# EAGLE design hh (EAGLE 8.7.1)
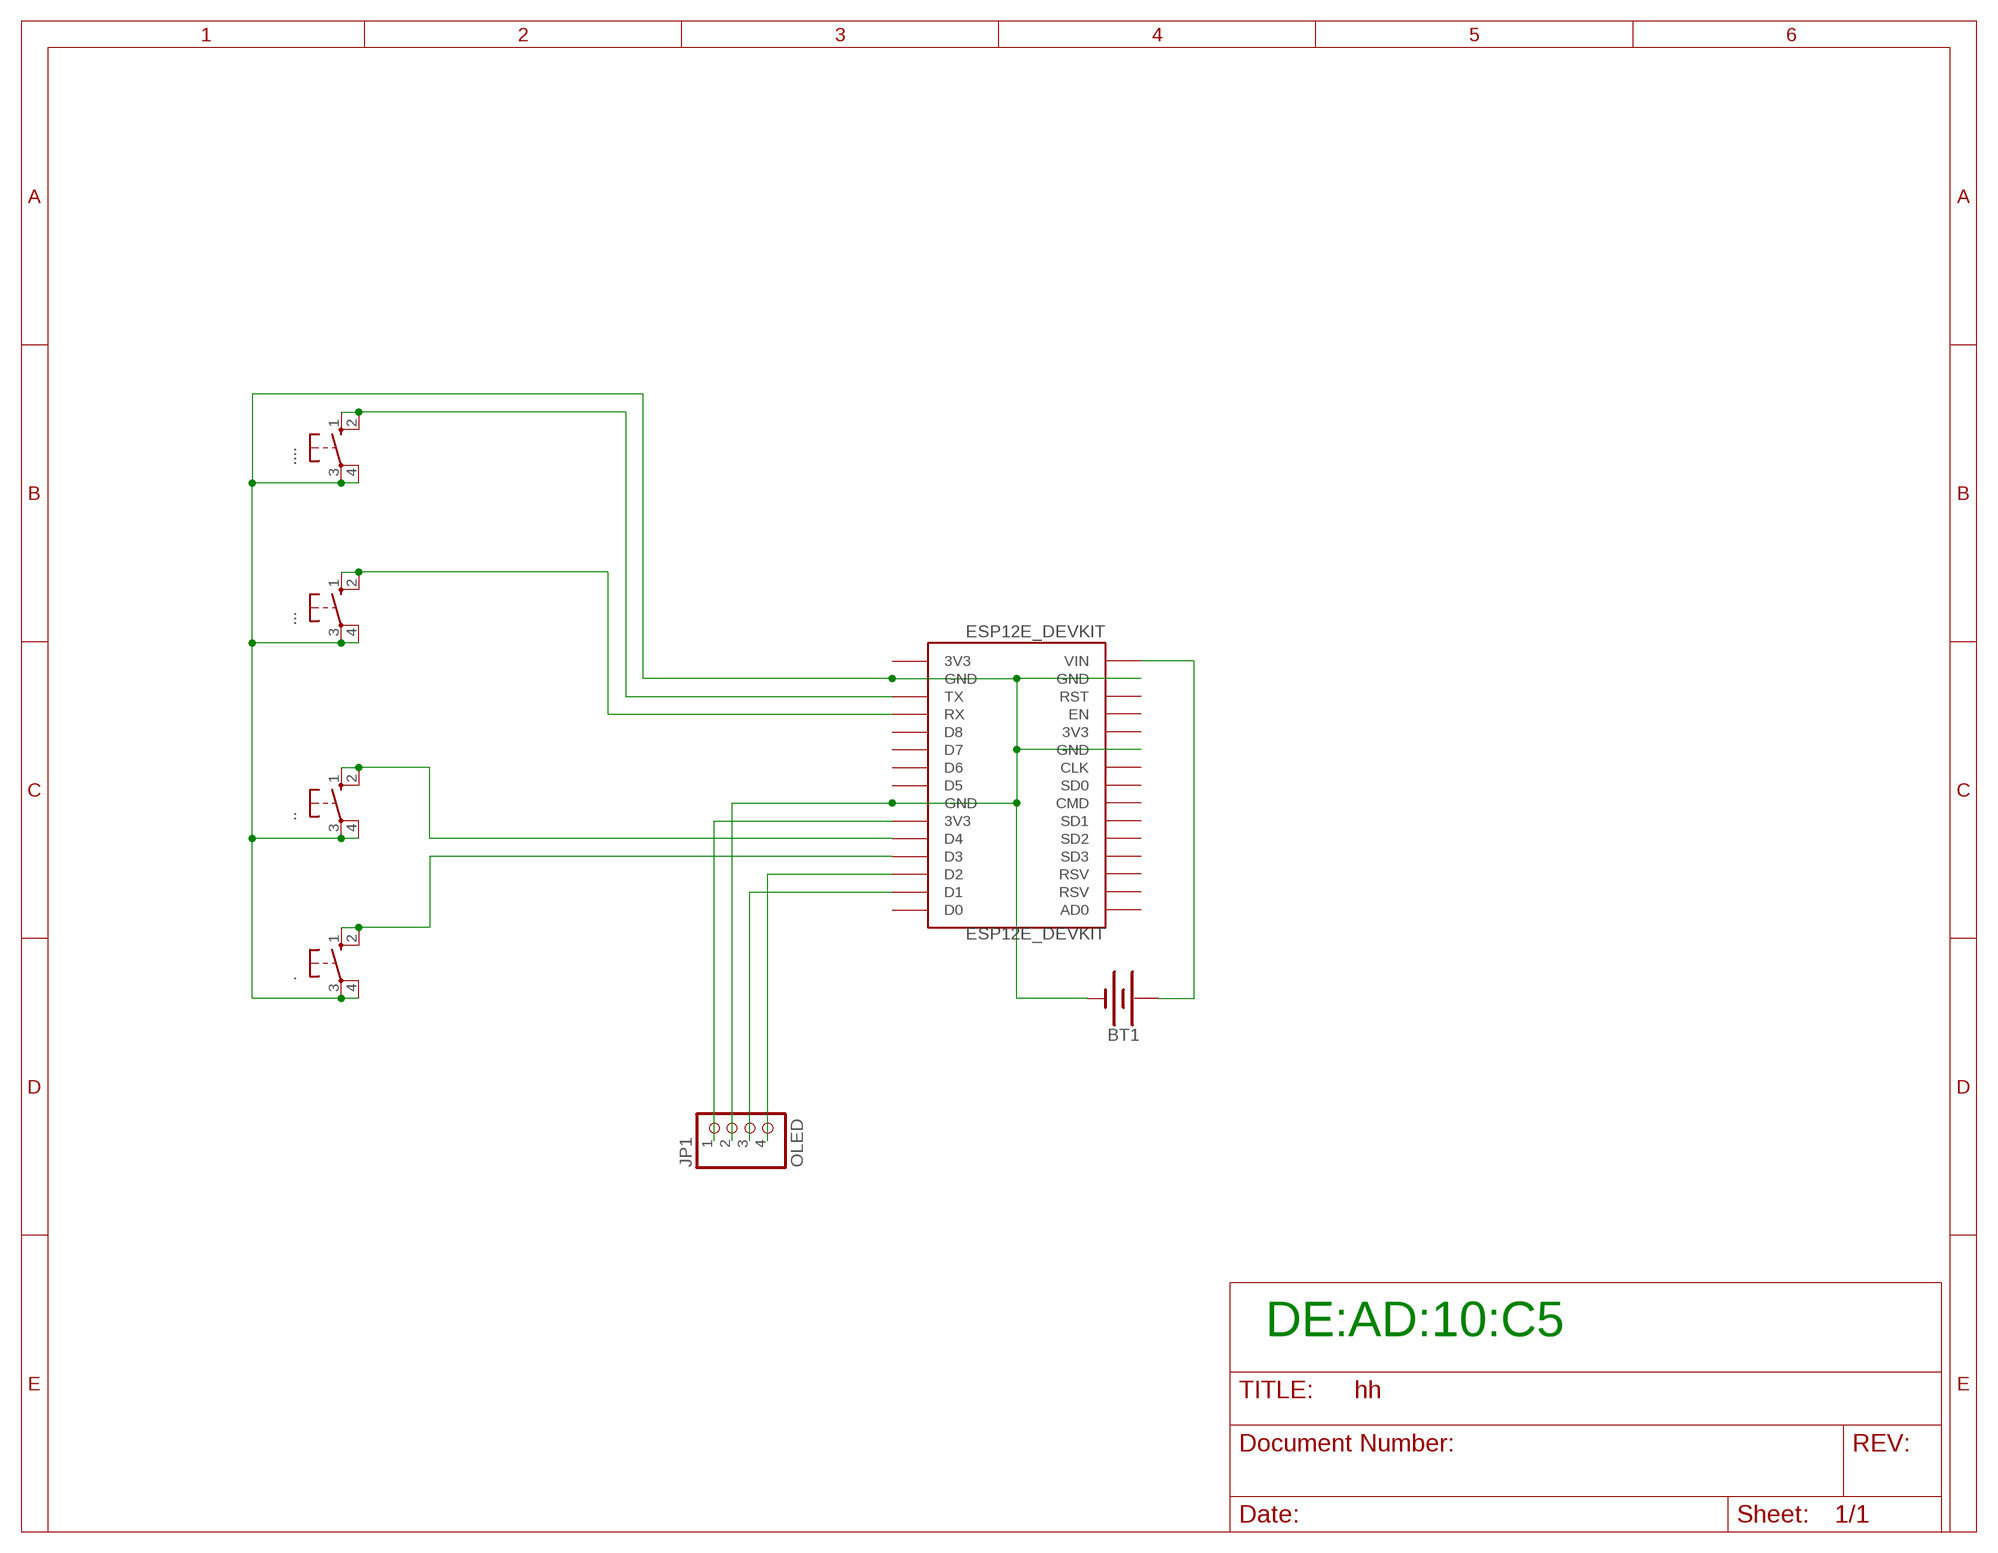
[diagram p0: schematic, sheet 1]

## Parts
.  10-XX  [B3F-10XX]
..  10-XX  [B3F-10XX]
...  10-XX  [B3F-10XX]
....  10-XX  [B3F-10XX]
BT1  BATTERY-18650  [BATTERY_18650-HOLDER]
ESP12E_DEVKIT  ESP12E_DEVKIT  [ESP12E_DEVKIT]
JP1  OLED  PINHD-1X4  [1X04]

## Nets
N$1: ..3(P) ..4(P1) ...3(P) ...4(P1) ....3(P) ....4(P1) .....3(P) .....4(P1) BT1.GND@1(-) ESP12E_DEVKIT.GND@0(GND) ESP12E_DEVKIT.GND@1(GND) ESP12E_DEVKIT.GND@2(GND) ESP12E_DEVKIT.GND@3(GND) JP1.2
N$2: ..1(S) ..2(S1) ESP12E_DEVKIT.D3
N$3: ESP12E_DEVKIT.3V3@1(3V3) JP1.1
N$4: BT1.PWR@1(+) ESP12E_DEVKIT.VIN
N$5: ESP12E_DEVKIT.D1 JP1.3
N$6: ESP12E_DEVKIT.D2 JP1.4
N$7: ...1(S) ...2(S1) ESP12E_DEVKIT.D4
N$8: ....1(S) ....2(S1) ESP12E_DEVKIT.RX
N$9: .....1(S) .....2(S1) ESP12E_DEVKIT.TX
Unconnected: ESP12E_DEVKIT.3V3@0(3V3) ESP12E_DEVKIT.3V3@2(3V3) ESP12E_DEVKIT.AD0 ESP12E_DEVKIT.CLK ESP12E_DEVKIT.CMD ESP12E_DEVKIT.D0 ESP12E_DEVKIT.D5 ESP12E_DEVKIT.D6 ESP12E_DEVKIT.D7 ESP12E_DEVKIT.D8 ESP12E_DEVKIT.EN ESP12E_DEVKIT.RST ESP12E_DEVKIT.RSV@0(RSV) ESP12E_DEVKIT.RSV@1(RSV) ESP12E_DEVKIT.SD0 ESP12E_DEVKIT.SD1 ESP12E_DEVKIT.SD2 ESP12E_DEVKIT.SD3

## Notes on the sheet
- DE:AD:10:C5

## Library data of the parts
. .. ... .... = switch-omron:10-XX: OMRON SWITCH; MPN: B3F-1000; OC_FARNELL: 176432; OC_NEWARK: 36M3542
BT1 = SF_Batteries:BATTERY: Battery - Single Cell A variety of battery chemistries, sizes, and footprints. Device List: 20MM_PTH - Coin Cell Battery Holder - 20mm (PTH) <https://www.sparkfun.com/products/783> 12MM_SMD - Coin Cell Battery Holder - 12mm (SMD) <https://www.sparkfun.com/products/10592> 12MM_PTH - Coin Cell Battery Holder - 12mm (PTH) <https://www.sparkfun.com/products/7948> 20MM_SMD - 20mm Coin Cell Battery Holder (SMD) (2 legs) Used on the Big Time Watch Kit <https://www.sparkfun.com/products/11734> 20MM_SMD_4LEGS - Coin Cell Battery Holder - 20mm (SMD) <https://www.sparkfun.com/products/11892> 20MM_SMD_4LEGS_OVERPASTE - Coin Cell Battery Holder - 20mm (SMD) <https://www.sparkfun.com/products/11892> (Over-paste on the legs) 24.5MM_PTH - Coin Cell Battery Holder - 24.5mm (PTH) <https://www.sparkfun.com/products/8863> 9V - 9V Battery Holder - PC Mount Used on the SparkFun SparkPunk Sound Kit <https://www.sparkfun.com/products/11177> and SparkFun SparkPunk Sequencer Kit <https://www.sparkfun.com/products/12707> 18650 - Battery Holder - 18650 (PTH) <https://www.sparkfun.com/products/13113> AA - Battery Holder - 1xAA (PTH) <https://www.sparkfun.com/products/7949> AAA - Battery Holder - 1xAAA (PTH) <https://www.sparkfun.com/products/12718> AA_KIT - Battery Holder - 1xAA (PTH) <https://www.sparkfun.com/products/7949> Special kit package - pads only have exposed copper on one side of the board. AAA_KIT - Battery Holder - 1xAAA (PTH) <https://www.sparkfun.com/products/12718> Special kit package - pads only have exposed copper on one side of the board.; PROD_ID: BATT-12327; SF_SKU: PRT-13113
ESP12E_DEVKIT = ESP12E_DEVKIT:ESP12E_DEVKIT: ESP12E DEVKIT BOARD
JP1 = pinhead:PINHD-1X4: PIN HEADER

## Board
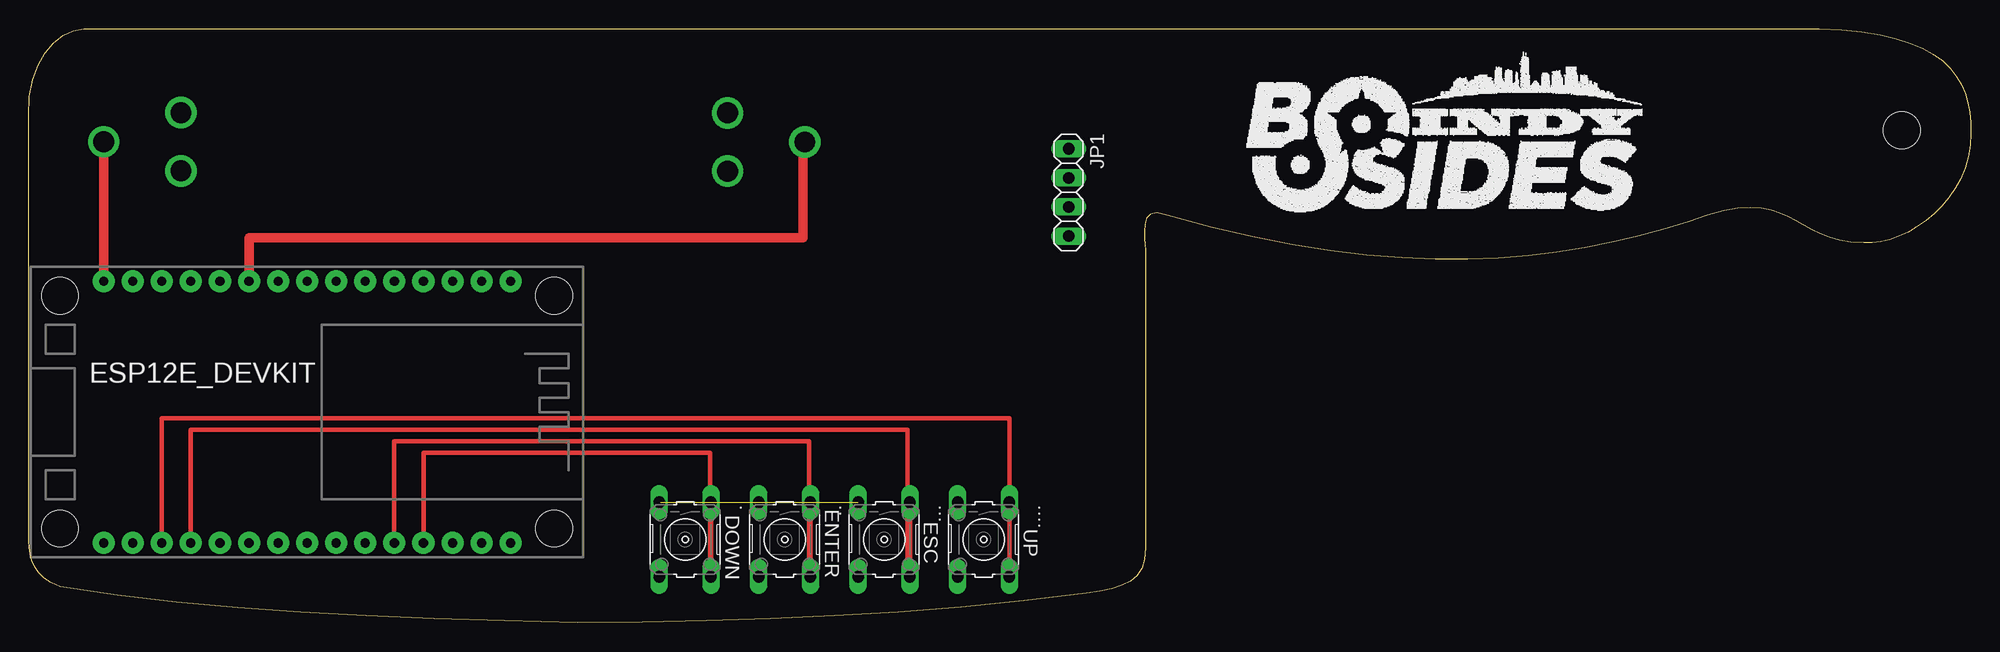
[diagram p1: board, top side]
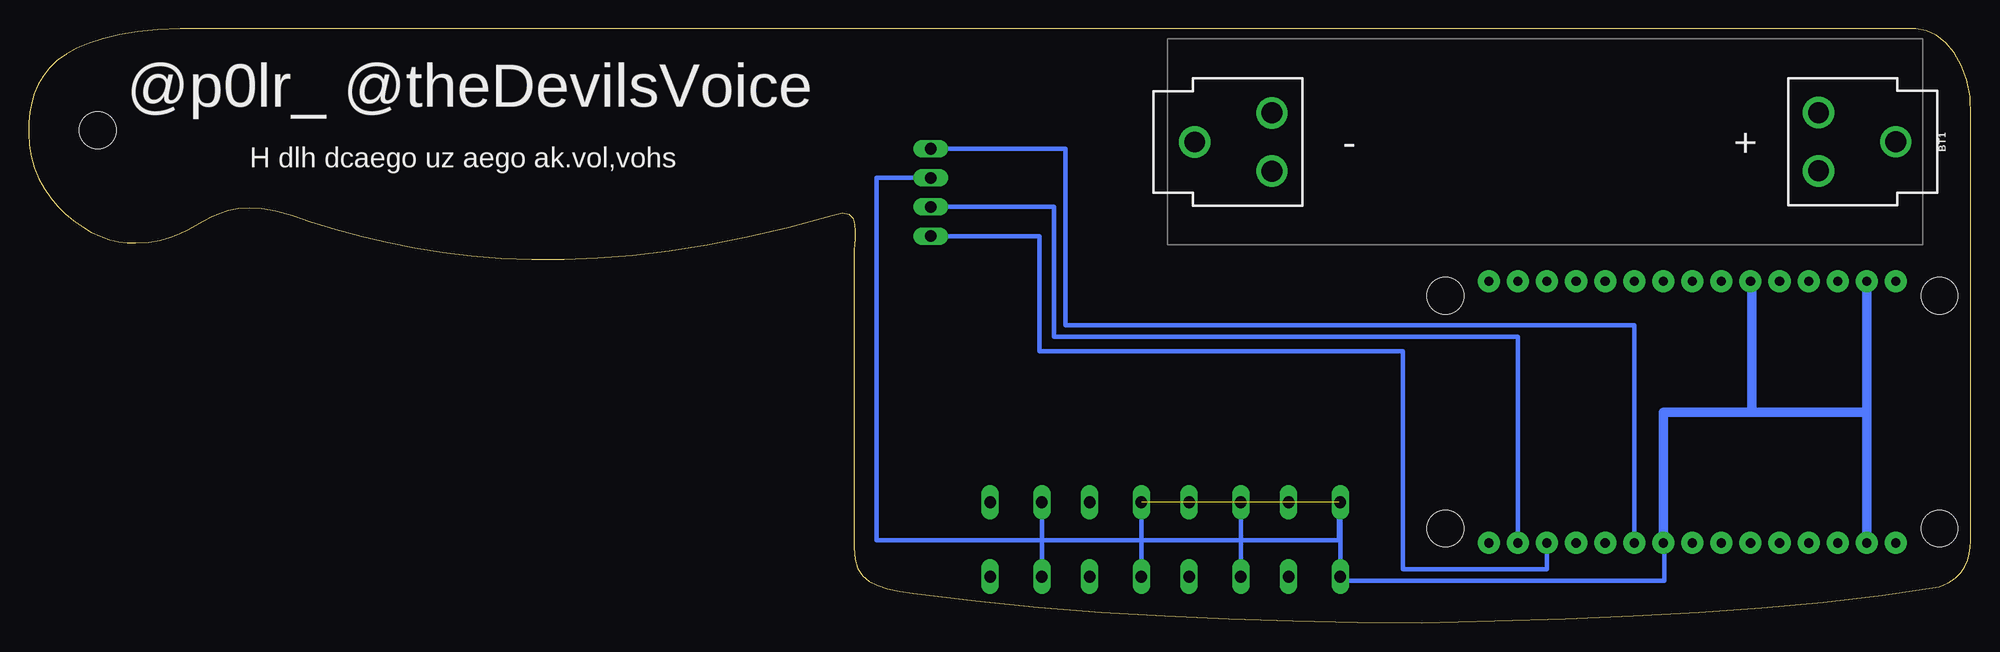
[diagram p2: board, bottom side, seen from below]

Size 169.71 x 51.92 mm. Coordinates in mm from the lower left corner, seen from the top.
Outline: 47.97,0 41.57,0.18 35.41,0.39 29.48,0.63 23.77,0.93 18.25,1.32 12.92,1.8 7.76,2.41 2.75,3.17 1.97,3.49 1.35,3.9 0.87,4.39 0.53,4.92 0.29,5.48 0.14,6.05 0.05,6.6 0,7.12 0,44.3 0.08,45.96 0.37,47.44 0.84,48.73 1.47,49.82 2.21,50.69 3.04,51.33 3.92,51.75 4.82,51.92 156.45,51.92 158.42,51.81 160.19,51.63 161.78,51.37 163.19,51.04 164.43,50.64 165.51,50.19 166.44,49.67 167.24,49.09 167.9,48.46 168.44,47.77 168.87,47.04 169.2,46.27 169.44,45.46 169.6,44.6 169.69,43.71 169.71,42.8 169.67,41.73 169.5,40.71 169.22,39.74 168.83,38.82 168.35,37.95 167.8,37.15 167.17,36.4 166.49,35.73 165.77,35.12 165,34.59 164.22,34.14 163.43,33.77 162.64,33.49 161.85,33.3 161.1,33.2 160.37,33.2 159.23,33.26 158.23,33.42 157.34,33.67 156.54,33.99 155.8,34.35 155.11,34.73 154.44,35.11 153.75,35.47 153.03,35.79 152.26,36.05 151.41,36.22 150.45,36.28 149.35,36.21 148.11,36 146.68,35.62 145.06,35.04 142.87,34.39 140.63,33.8 138.34,33.26 135.98,32.79 133.55,32.4 131.04,32.09 128.44,31.88 125.74,31.77 122.93,31.76 120,31.88 116.95,32.13 113.76,32.52 110.43,33.05 106.94,33.73 103.3,34.58 99.48,35.6 98.62,35.81 98.04,35.71 97.69,35.35 97.52,34.83 97.48,34.22 97.51,33.59 97.56,33.02 97.58,32.58 97.58,6.58 97.51,5.57 97.27,4.76 96.86,4.13 96.28,3.64 95.54,3.28 94.64,3 93.6,2.79 92.41,2.6 86.97,1.92 81.48,1.37 75.96,0.94 70.4,0.61 64.82,0.36 59.22,0.19 53.6,0.08 47.97,0
Copper layers (1*16): Top 0.0356mm / dielectric 1.5011mm / Bottom 0.0356mm
Design rules "oshpark-2layer": minimum track width 6mil, minimum drill 13mil, track to track 6mil, track to pad 6mil, pad to pad 6mil, via to via 6mil, smd to smd 6mil, copper to edge 15mil, drill to drill 6mil, minimum pad ring 7mil, minimum via ring 7mil, stop-mask expansion 2.5mil, vias tented up to drill 0mil, thermal gap 10mil
Holes 3.2 mm at 163.69,43.04

### Footprints (pad centres in the part's own frame; a part is rotated, then mirrored left to right if it is on the bottom)
B3F-10XX = drill 1.016 long: 1 -3.251,2.261; 2 3.251,2.261; 3 -3.251,-2.261; 4 3.251,-2.261
BATTERY_18650-HOLDER = drill 1.829: GND@1 30.628,0.01; GND@2 23.88,2.55; GND@3 23.88,-2.53; PWR@1 -30.628,-0.01; PWR@2 -23.88,2.53; PWR@3 -23.88,-2.55
ESP12E_DEVKIT = drill 0.8 pad 1.93: 3V3@0 -11.43,-7.62; 3V3@1 11.43,5.08; 3V3@2 11.43,-17.78; AD0 -11.43,17.78; CLK -11.43,-2.54; CMD -11.43,2.54; D0 11.43,17.78; D1 11.43,15.24; D2 11.43,12.7; D3 11.43,10.16; D4 11.43,7.62; D5 11.43,0; D6 11.43,-2.54; D7 11.43,-5.08; D8 11.43,-7.62; EN -11.43,-10.16; GND@0 -11.43,-5.08; GND@1 -11.43,-15.24; GND@2 11.43,2.54; GND@3 11.43,-15.24; RST -11.43,-12.7; RSV@0 -11.43,15.24; RSV@1 -11.43,12.7; RX 11.43,-10.16; SD0 -11.43,0; SD1 -11.43,5.08; SD2 -11.43,7.62; SD3 -11.43,10.16; TX 11.43,-12.7; VIN -11.43,-17.78 | hole 3.2: -10.16,21.59; 10.16,21.59; 10.16,-21.59; -10.16,-21.59
1X04 = drill 1.016 long: 1 -3.81,0; 2 -1.27,0; 3 1.27,0; 4 3.81,0

### Placement (x,y rotation side)
.  57.37,7.29 270 top
..  66.06,7.29 270 top
...  74.75,7.29 270 top
....  83.44,7.29 270 top
BT1  37.19,42.02 180 bottom
ESP12E_DEVKIT  24.34,18.42 270 top
JP1  90.88,37.61 270 top

### Tracks (layer width: path | path; a pad name or v marks a point on that pad's centre or on a via)
N$1  (2 unrouted)
  Top 0.406: BT1.GND@1 67.67,42.01
  Top 0.813: 67.67,42.01 67.67,33.64 19.26,33.64 ESP12E_DEVKIT.GND@0
  Bottom 0.406: ...3 ...4 | 81.18,7.23 .....3 | ....3 ....4 | ESP12E_DEVKIT.GND@0 19.16,29.85 | 81.18,7.23 55.23,7.23 55.23,10.54 ..3 ..4 55.1,3.67 26.78,3.67 26.78,6.99 ESP12E_DEVKIT.GND@2 | 81.18,7.23 .....4 | JP1.2 95.61,38.88 95.61,7.23 81.18,7.23
  Bottom 0.813: ESP12E_DEVKIT.GND@3 9.1,18.4 | 19.16,29.85 19.16,18.4 | 19.16,18.4 9.1,18.4 | 9.1,18.4 ESP12E_DEVKIT.GND@1 | 19.16,18.4 26.88,18.4 ESP12E_DEVKIT.GND@2
N$2
  Top 0.406: ..1 ..2 59.55,4.04 59.55,14.85 34.5,14.85 ESP12E_DEVKIT.D3
N$3
  Bottom 0.406: JP1.1 79.1,41.42 79.1,26.02 29.42,26.02 ESP12E_DEVKIT.3V3@1
N$4
  Top 0.406: BT1.PWR@1
  Top 0.813: BT1.PWR@1 ESP12E_DEVKIT.VIN
N$5
  Bottom 0.406: JP1.3 80.12,36.34 80.12,25.01 39.58,25.01 ESP12E_DEVKIT.D1
N$6
  Bottom 0.406: JP1.4 81.39,33.8 81.39,23.74 49.64,23.74 49.64,4.69 37.04,4.69 ESP12E_DEVKIT.D2
N$7
  Top 0.406: ...1 ...2 68.18,4.04 68.18,15.86 31.96,15.86 ESP12E_DEVKIT.D4
N$8
  Top 0.406: ....1 ....2 76.82,4.04 76.82,16.88 14.18,16.88 ESP12E_DEVKIT.RX
N$9
  Top 0.406: .....1 .....2 85.71,17.89 11.64,17.89 ESP12E_DEVKIT.TX

### Text on the board
tPlace: DOWN | ENTER | ESC | UP
bPlace: @p0lr_ @theDevilsVoice | H dlh dcaego uz aego ak.vol,vohs